# EAGLE design Basic arduino (EAGLE 9.6.2)
CNAME: MICROCONTOLLER+POWER+HEADERS; CREVISION: V1.0.0; TEST: Basic Arduino
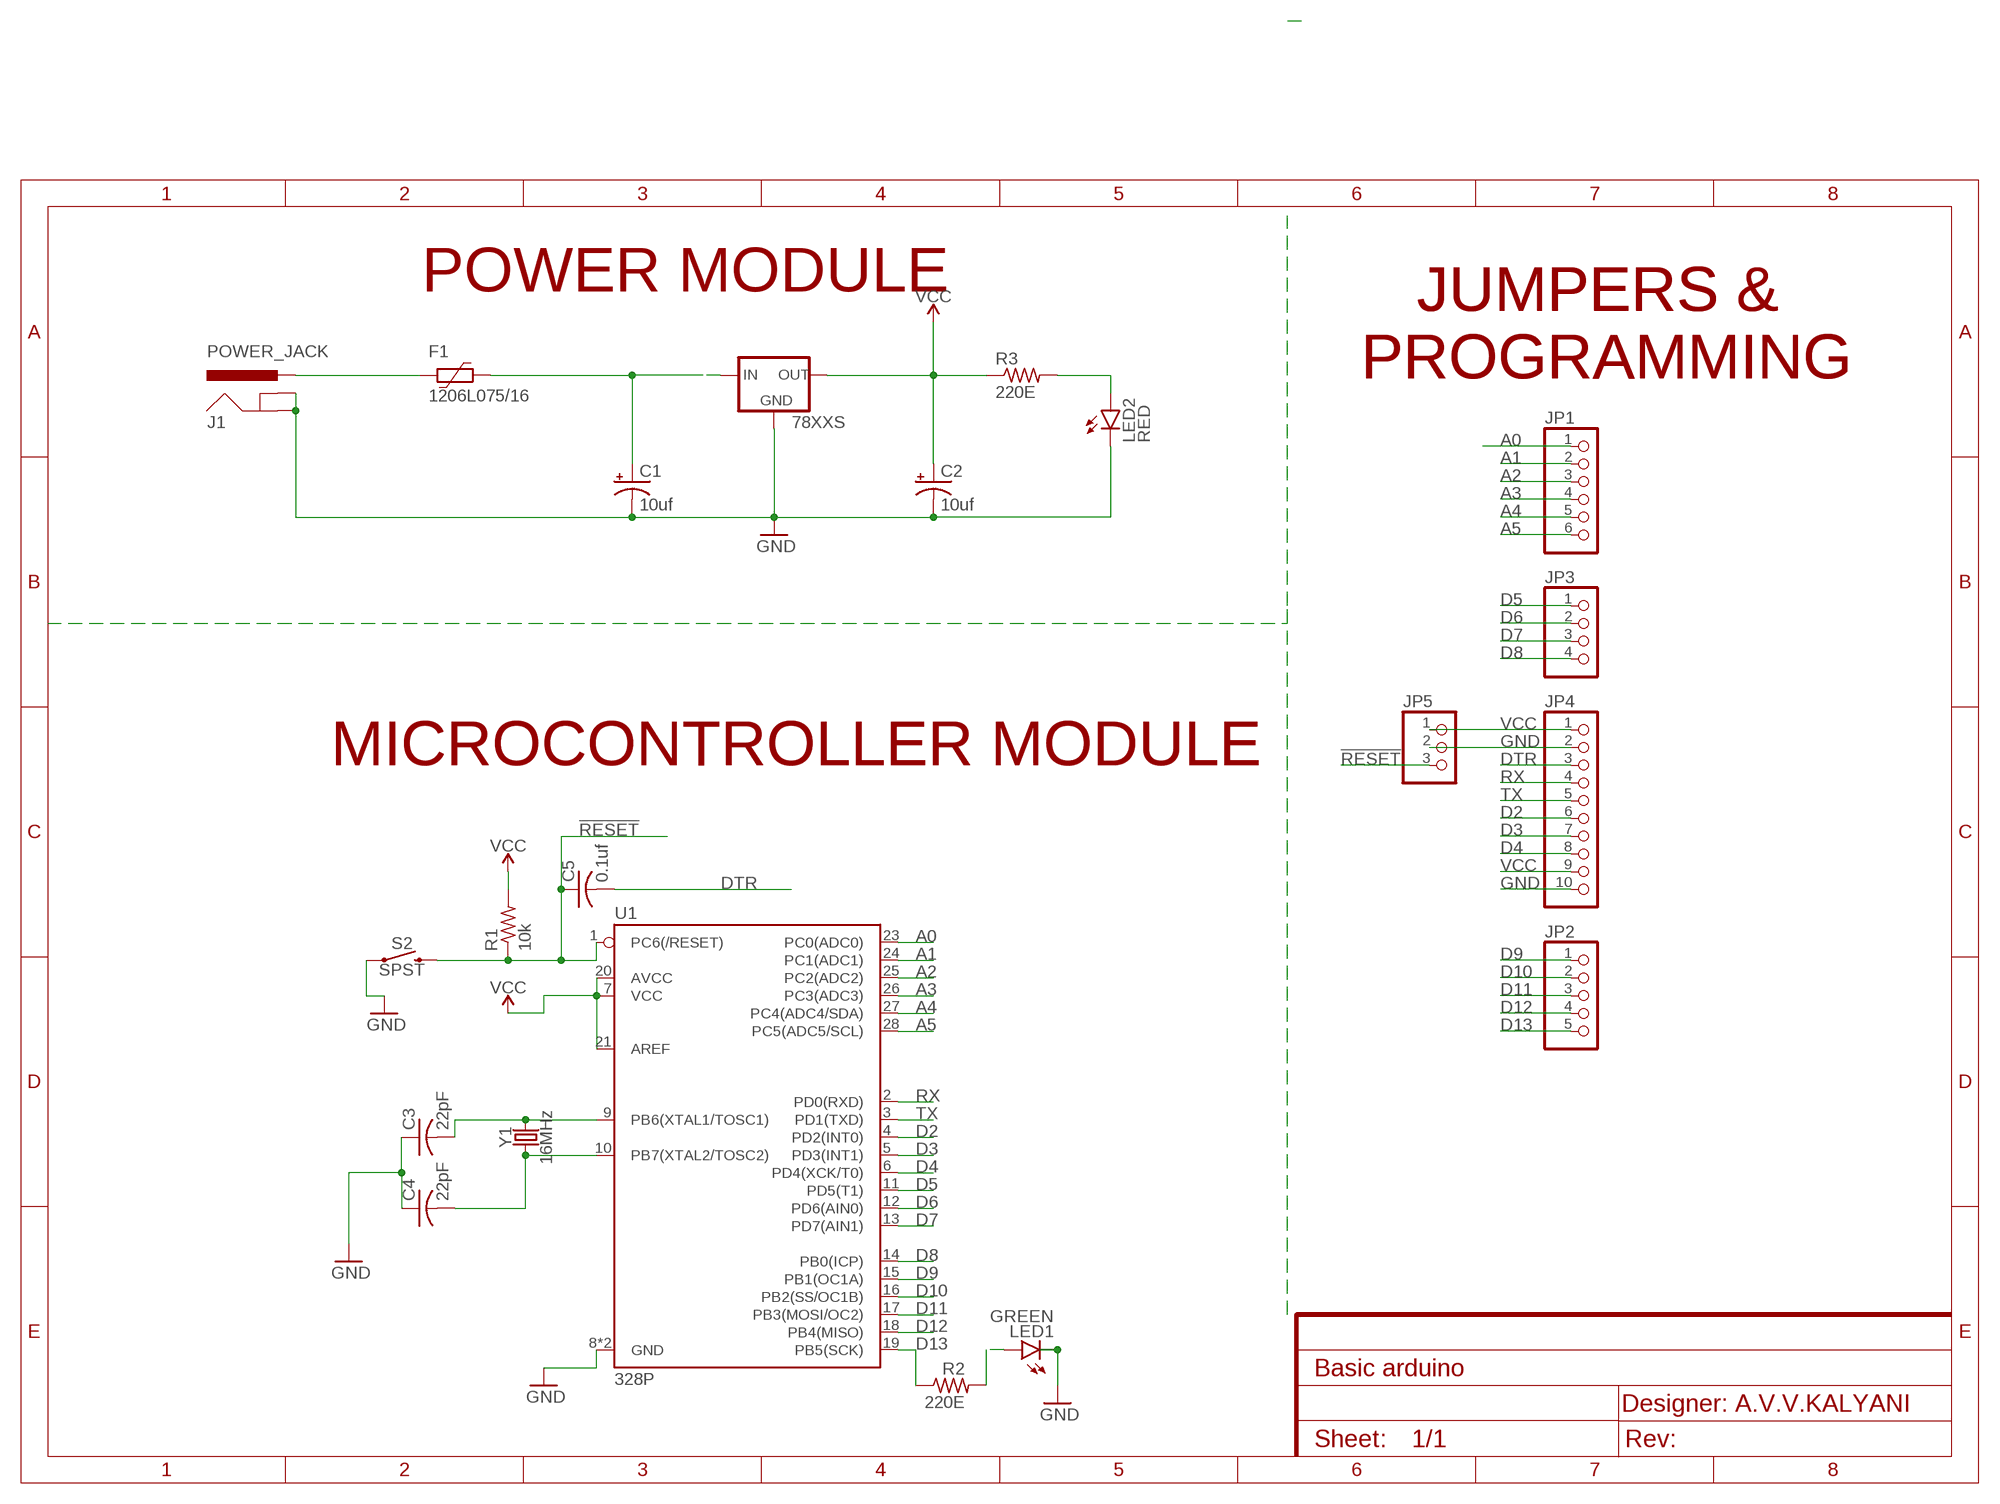
[diagram p0: schematic, sheet 1]

## Parts
78XXS  78XXS  [78XXS]
C1  10uf  CPOL-USE2.5-6  [E2,5-6]
C2  10uf  CPOL-USE2.5-6  [E2,5-6]
C3  22pF  C-US025-025X050  [C025-025X050]
C4  22pF  C-US025-025X050  [C025-025X050]
C5  0.1uf  C-US025-024X044  [C025-024X044]
F1  1206L075/16  [1206L]
J1  POWER_JACK  [POWER_JACK_PTH]
JP1  PINHD-1X6  [1X06]
JP2  PINHD-1X5  [1X05]
JP3  PINHD-1X4  [1X04]
JP4  PINHD-1X10  [1X10]
JP5  PINHD-1X3  [1X03]
LED1  GREEN  LED3MM  [LED3MM]
LED2  RED  LED3MM  [LED3MM]
R1  10k  R-US_0204/7  [0204/7]
R2  220E  R-US_0204/7  [0204/7]
R3  220E  R-US_0204/7  [0204/7]
S2  SPST  MOMENTARY-SWITCH-SPST-PTH-6.0MM  [TACTILE_SWITCH_PTH_6.0MM]
U1  328P  ATMEGA328P_PDIP  [DIP28]
Y1  16MHz  CRYSTAL-16MHZPTH-HC49US  [HC49US]

## Nets
!RESET: C5.1 JP5.3 R1.1 S2.3 U1.1(PC6(/RESET))
A0: JP1.1 U1.23(PC0(ADC0))
A1: JP1.2 U1.24(PC1(ADC1))
A2: JP1.3 U1.25(PC2(ADC2))
A3: JP1.4 U1.26(PC3(ADC3))
A4: JP1.5 U1.27(PC4(ADC4/SDA))
A5: JP1.6 U1.28(PC5(ADC5/SCL))
D2: JP4.6 U1.4(PD2(INT0))
D3: JP4.7 U1.5(PD3(INT1))
D4: JP4.8 U1.6(PD4(XCK/T0))
D5: JP3.1 U1.11(PD5(T1))
D6: JP3.2 U1.12(PD6(AIN0))
D7: JP3.3 U1.13(PD7(AIN1))
D8: JP3.4 U1.14(PB0(ICP))
D9: JP2.1 U1.15(PB1(OC1A))
D10: JP2.2 U1.16(PB2(SS/OC1B))
D11: JP2.3 U1.17(PB3(MOSI/OC2))
D12: JP2.4 U1.18(PB4(MISO))
D13: JP2.5 R2.1 U1.19(PB5(SCK))
DTR: C5.2 JP4.3
GND: 78XXS.GND C1.- C2.- C3.1 C4.1 J1.GND J1.GNDBREAK JP4.2 JP4.10 JP5.2 LED1.K(C) LED2.K(C) S2.1 U1.8(GND) U1.22(GND)
N$1: 78XXS.IN C1.+ F1.1
N$2: C3.2 U1.9(PB6(XTAL1/TOSC1)) Y1.2
N$3: C4.2 U1.10(PB7(XTAL2/TOSC2)) Y1.1
N$4: LED2.A R3.2
N$6: F1.2 J1.PWR
N$9: LED1.A R2.2
RX: JP4.4 U1.2(PD0(RXD))
TX: JP4.5 U1.3(PD1(TXD))
VCC: 78XXS.OUT C2.+ JP4.1 JP4.9 JP5.1 R1.2 R3.1 U1.7(VCC) U1.20(AVCC) U1.21(AREF)

## Notes on the sheet
- POWER MODULE
- JUMPERS & 
  PROGRAMMING
- JUMPERS & 
  PROGRAMMING
- JUMPERS & 
  PROGRAMMING
- MICROCONTROLLER MODULE | MICROCONTROLLER MODULE
- Designer: A.V.V.KALYANI

## Library data of the parts
78XXS = v-reg:78XXS: VOLTAGE REGULATOR
C1 C2 = rcl:CPOL-US: POLARIZED CAPACITOR, American symbol; SPICEPREFIX: C
C3-C5 = rcl:C-US: CAPACITOR, American symbol; SPICEPREFIX: C
F1 = polyfuse-smd_20:?: Polyfuse Resettable PTC Source: http://www.littelfuse.com/products/resettable-ptcs.aspx; MF: Littelfuse; MPN: 1206L075/16; OC_FARNELL: unknown; OC_NEWARK: unknown
J1 = SparkFun-Connectors:POWER_JACK: Power Jack Connector This is the standard 5.5mm barrel jack for power. The PTH is the most common, proven, reliable, footprint. The Slot footprint only works if the mill layer is transmitted to the PCB fab house so be warned. Here are the connectors we sell at SparkFun: DC Barrel Power Jack/Connector <https://www.sparkfun.com/products/119> (PRT-00119) DC Barrel Power Jack/Connector (SMD) <https://www.sparkfun.com/products/12748> (PRT-12748) DC Barrel Jack Adapter - Breadboard Compatible <https://www.sparkfun.com/products/10811> (PRT-10811) It is used on this SparkFun product (and many, many others): SparkFun RedBoard - Programmed with Arduino <https://www.sparkfun.com/products/12757> (DEV-12757) Also, if you need a mating power supply or connector, please check these out: Wall Adapter Power Supply - 9VDC 650mA <https://www.sparkfun.com/products/298> (TOL-00298) DC Barrel Jack Adapter - Male <https://www.sparkfun.com/products/10287> (PRT-10287); PROD_ID: CONN-08197
JP1 = pinhead:PINHD-1X6: PIN HEADER
JP2 = pinhead:PINHD-1X5: PIN HEADER
JP3 = pinhead:PINHD-1X4: PIN HEADER
JP4 = pinhead:PINHD-1X10: PIN HEADER
JP5 = pinhead:PINHD-1X3: PIN HEADER
LED1 LED2 = led:LED: LED OSRAM: - CHIPLED LG R971, LG N971, LY N971, LG Q971, LY Q971, LO R971, LY R971 LH N974, LH R974 LS Q976, LO Q976, LY Q976 LO Q996 - Hyper CHIPLED LW Q18S LB Q993, LB Q99A, LB R99A - SideLED LS A670, LO A670, LY A670, LG A670, LP A670 LB A673, LV A673, LT A673, LW A673 LH A674 LY A675 LS A676, LA A676, LO A676, LY A676, LW A676 LS A679, LY A679, LG A679 - Hyper Micro SIDELED® LS Y876, LA Y876, LO Y876, LY Y876 LT Y87S - SmartLED LW L88C, LW L88S LB L89C, LB L89S, LG L890 LS L89K, LO L89K, LY L89K LS L896, LA L896, LO L896, LY L896 - TOPLED LS T670, LO T670, LY T670, LG T670, LP T670 LSG T670, LSP T670, LSY T670, LOP T670, LYG T670 LG T671, LOG T671, LSG T671 LB T673, LV T673, LT T673, LW T673 LH T674 LS T676, LA T676, LO T676, LY T676, LB T676, LH T676, LSB T676, LW T676 LB T67C, LV T67C, LT T67C, LS T67K, LO T67K, LY T67K, LW E67C LS E67B, LA E67B, LO E67B, LY E67B, LB E67C, LV E67C, LT E67C LW T67C LS T679, LY T679, LG T679 LS T770, LO T770, LY T770, LG T770, LP T770 LB T773, LV T773, LT T773, LW T773 LH T774 LS E675, LA E675, LY E675, LS T675 LS T776, LA T776, LO T776, LY T776, LB T776 LHGB T686 LT T68C, LB T68C - Hyper Mini TOPLED® LB M676 - Mini TOPLED Santana® LG M470 LS M47K, LO M47K, LY M47K Source: http://www.osram.convergy.de LUXEON: - LUMILED® LXK2-PW12-R00, LXK2-PW12-S00, LXK2-PW14-U00, LXK2-PW14-V00 LXK2-PM12-R00, LXK2-PM12-S00, LXK2-PM14-U00 LXK2-PE12-Q00, LXK2-PE12-R00, LXK2-PE12-S00, LXK2-PE14-T00, LXK2-PE14-U00 LXK2-PB12-K00, LXK2-PB12-L00, LXK2-PB12-M00, LXK2-PB14-N00, LXK2-PB14-P00, LXK2-PB14-Q00 LXK2-PR12-L00, LXK2-PR12-M00, LXK2-PR14-Q00, LXK2-PR14-R00 LXK2-PD12-Q00, LXK2-PD12-R00, LXK2-PD12-S00 LXK2-PH12-R00, LXK2-PH12-S00 LXK2-PL12-P00, LXK2-PL12-Q00, LXK2-PL12-R00 Source: www.luxeon.com KINGBRIGHT: KA-3528ASYC Source: www.kingbright.com
R1-R3 = rcl:R-US_: RESISTOR, American symbol; SPICEPREFIX: R
S2 = SparkFun-Switches:MOMENTARY-SWITCH-SPST: Momentary Switch (Pushbutton) - SPST Normally-open (NO) SPST momentary switches (buttons, pushbuttons). Variants PTH-12MM - 12mm square, through-hole Momentary Pushbutton Switch - 12mm Square <https://www.sparkfun.com/products/9190> (COM-09190) PTH-6.0MM, PTH-6.0MM-KIT - 6.0mm square, through-hole Mini Pushbutton Switch <https://www.sparkfun.com/products/97> (COM-00097) KIT package intended for soldering kit's - only one side of pads' copper is exposed. PTH-RIGHT-ANGLE-KIT - Right-angle, through-hole Right Angle Tactile Button <https://www.sparkfun.com/products/10791> - Used on SparkFun BigTime Watch Kit <https://www.sparkfun.com/products/11734> SMD-12MM - 12mm square, surface-mount Tactile Button - SMD (12mm) <https://www.sparkfun.com/products/12993> (COM-12993) Used on SparkFun PicoBoard <https://www.sparkfun.com/products/11888> SMD-4.5MM - 4.5mm Square Trackball Switch Used on SparkFun Blackberry Trackballer Breakout <https://www.sparkfun.com/products/13169> SMD-4.6MMX2.8MM - 4.60mm x 2.80mm, surface mount Used on SparkFun Pro Micro - RP2040 <https://www.sparkfun.com/products/17717> SMD-5.2MM, SMD-5.2-REDUNDANT - 5.2mm square, surface-mount Mini Pushbutton Switch - SMD <https://www.sparkfun.com/products/8720> (COM-08720) Used on Arduino Pro Mini <https://www.sparkfun.com/products/11114> REDUNDANT package connects both switch circuits together SMD-6.0X3.5MM - 6.0 x 3.5mm, surface mount Momentary Reset Switch SMD <https://www.sparkfun.com/products/8229> (COM-08229) SMD-6.2MM-TALL - 6.2mm square, surface mount Tactile Button - SMD (6mm) <https://www.sparkfun.com/products/12992> Used on SparkFun Digital Sandbox <https://www.sparkfun.com/products/12651> SMD-RIGHT-ANGLE - Right-angle, surface mount Used on SparkFun Block for Intel® Edison - Arduino <https://www.sparkfun.com/products/13036>; PROD_ID: SWCH-08441; SF_SKU: COM-00097
U1 = SparkFun-IC-Microcontroller:ATMEGA328P_PDIP: Atmel 328P Through hole ATMEGA328P uC used in the Arduino 32kb flash, 1k EEPROM, 2k SRAM Datasheet <http://www.sparkfun.com/datasheets/Components/SMD/ATMega328.pdf> SparkFun Products Storefront component: AVR 28 Pin 20MHz 32K 6A/D - ATMega328P <https://www.sparkfun.com/products/9061> (COM-09061) SparkFun Simon Says - Through-Hole Soldering Kit <https://www.sparkfun.com/products/10547> (KIT-10547) SparkFun Learn to Solder - Simon Says <https://www.sparkfun.com/products/13708> (KIT-13708) SparkFun BigTime Watch Kit <https://www.sparkfun.com/products/11734> (KIT-11734) SparkFun ClockIt <https://www.sparkfun.com/products/10930> (KIT-10930) SparkFun Serial Enabled LCD Kit <https://www.sparkfun.com/products/10097> (LCD-10097) SparkFun Simon Tilts - Through Hole Soldering Kit <https://www.sparkfun.com/products/12634> (KIT-12634) SparkFun Frequency Counter Kit <https://www.sparkfun.com/products/10140> (KIT-10140) FabFM Radio Kit <https://www.sparkfun.com/products/11043> (KIT-11043) SparkFun Binary Blaster Kit <https://www.sparkfun.com/products/12037> (KIT-12037) SparkFun Metro-Gnome <https://www.sparkfun.com/products/9236> (KIT-09236) ATmega328 with Arduino Optiboot (Uno) <https://www.sparkfun.com/products/10524> (DEV-10524); PROD_ID: IC-09136
Y1 = SparkFun-Clocks:CRYSTAL-16MHZ: 16MHz Crystal Digikey Example <http://www.digikey.com/product-search/en?keywords=535-9122-1-ND> Frequency: 16MHz Frequency Stability: ±50ppm Frequency Tolerance: ±20ppm Load Capacitance: 18pF SparkFun Products: Pro Micro -5V/16MHz <https://www.sparkfun.com/products/12640> SparkFun Serial Enabled LCD Kit <https://www.sparkfun.com/products/10097>; PROD_ID: XTAL-08181; SF_ID: COM-00536

## Board
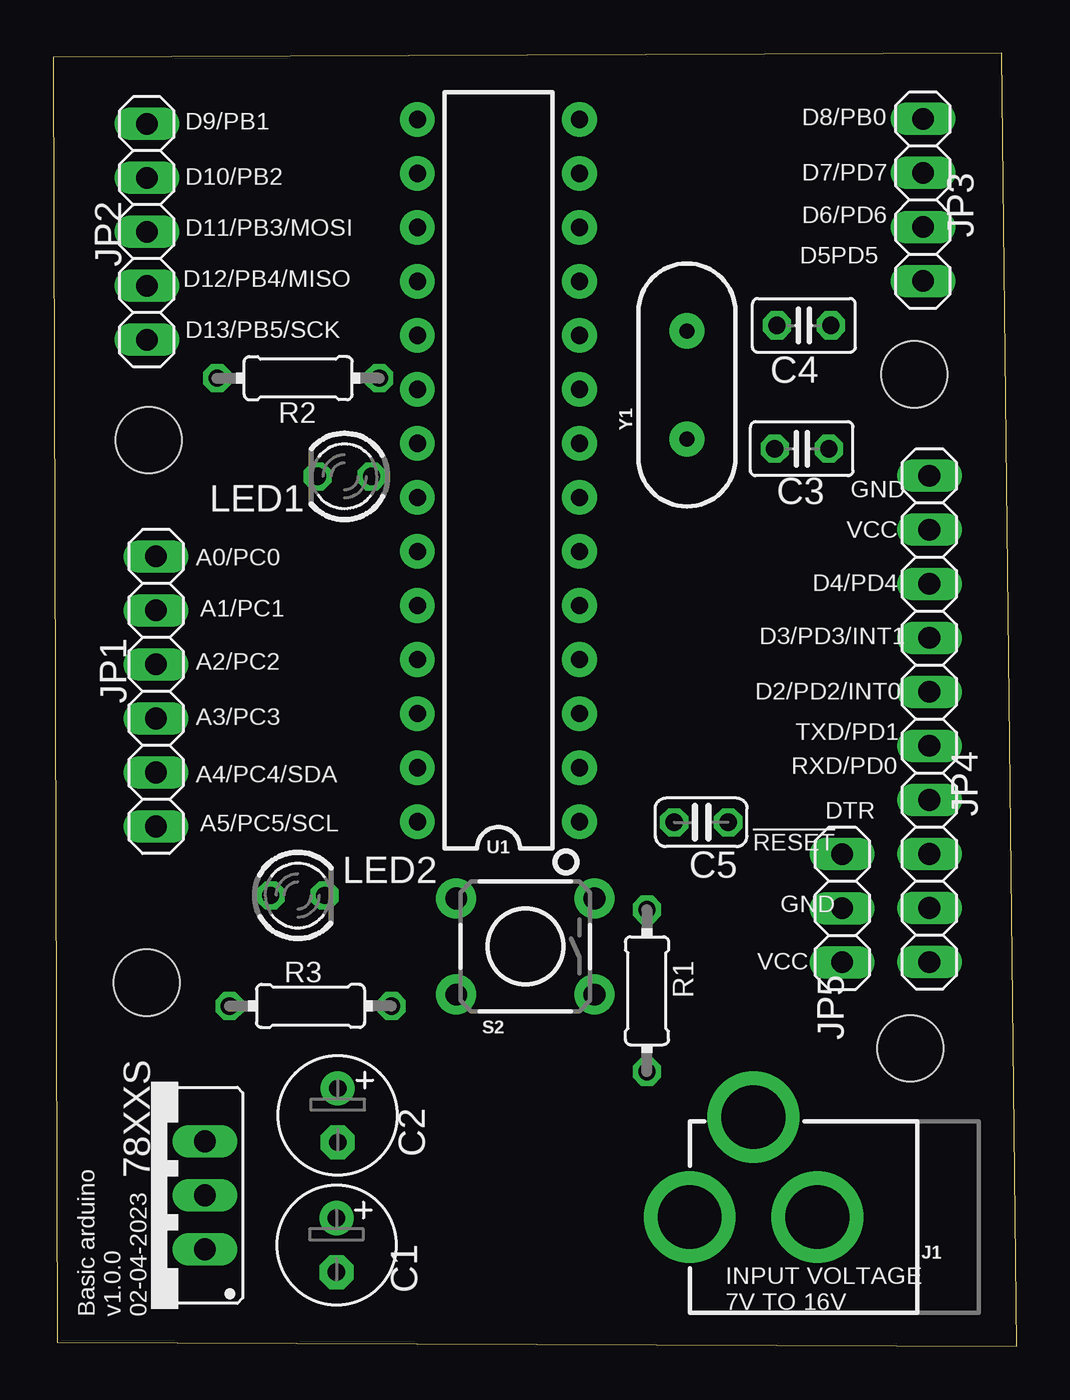
[diagram p1: board, top side]
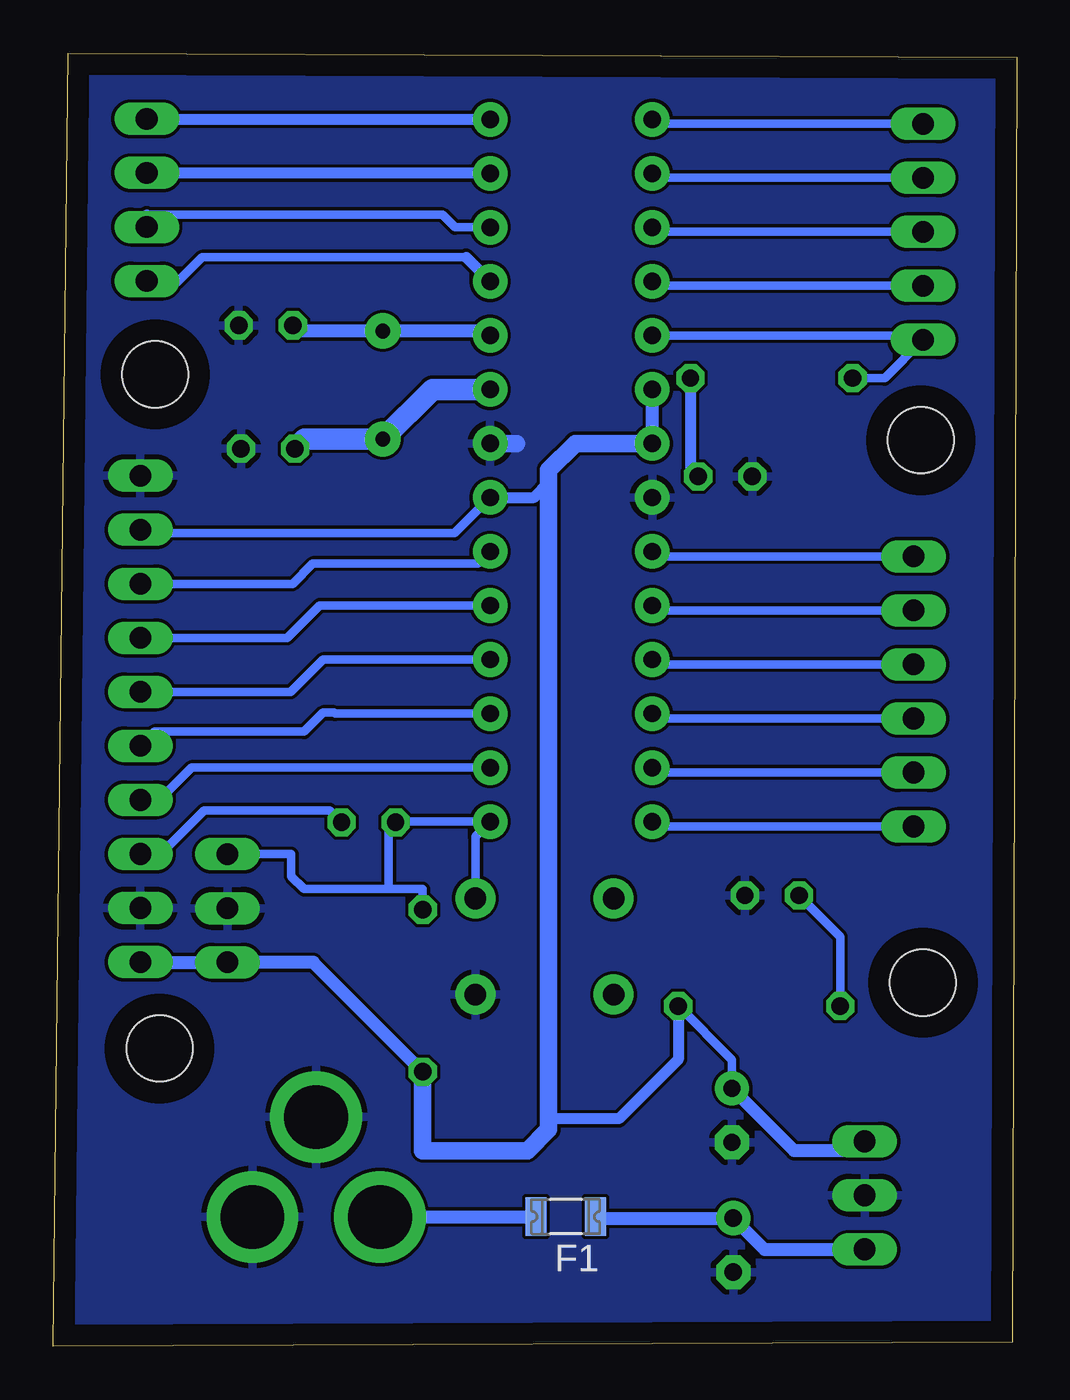
[diagram p2: board, bottom side, seen from below]

Size 45.3 x 60.8 mm. Coordinates in mm from the lower left corner, seen from the top.
Outline: 0.2,0.2 45.3,0 44.6,60.8 0,60.6 0.2,0.2
Copper layers (1*16): Top 0.035mm / dielectric 1.5mm / Bottom 0.035mm
Design rules "default": minimum track width 6mil, minimum drill 0.35mm, track to track 6mil, track to pad 6mil, pad to pad 6mil, via to via 6mil, smd to smd 6mil, copper to edge 40mil, drill to drill 6mil, minimum pad ring 10mil, minimum via ring 8mil, stop-mask expansion 4mil, vias tented up to drill 0mil, thermal gap 10mil
Holes 3.1 mm at 40.3,14 4.4,17.1 40.5,45.7 4.5,42.6

### Footprints (pad centres in the part's own frame; a part is rotated, then mirrored left to right if it is on the bottom)
78XXS = drill 1.016 long: GND 0,-2.54; IN -2.54,-2.54; OUT 2.54,-2.54
E2,5-6 = drill 0.813 pad 1.6: + -1.27,0 | drill 0.813 pad 1.6 octagon: - 1.27,0
C025-025X050 = drill 0.813 octagon: 1 -1.27,0; 2 1.27,0
C025-024X044 = drill 0.813 octagon: 1 -1.27,0; 2 1.27,0
1206L = smd 1 x 1.8: 1 -1.4,0; 2 1.4,0
POWER_JACK_PTH = drill 2.997 pad 4.318: GND 0,7.7; GNDBREAK 4.7,10.7; PWR 0,13.7
1X06 = drill 1.016 long: 1 -6.35,0; 2 -3.81,0; 3 -1.27,0; 4 1.27,0; 5 3.81,0; 6 6.35,0
1X05 = drill 1.016 long: 1 -5.08,0; 2 -2.54,0; 3 0,0; 4 2.54,0; 5 5.08,0
1X04 = drill 1.016 long: 1 -3.81,0; 2 -1.27,0; 3 1.27,0; 4 3.81,0
1X10 = drill 1.016 long: 1 -11.43,0; 2 -8.89,0; 3 -6.35,0; 4 -3.81,0; 5 -1.27,0; 6 1.27,0; 7 3.81,0; 8 6.35,0; 9 8.89,0; 10 11.43,0
1X03 = drill 1.016 long: 1 -2.54,0; 2 0,0; 3 2.54,0
LED3MM = drill 0.813 octagon: A -1.27,0; K 1.27,0
0204/7 = drill 0.813 octagon: 1 -3.81,0; 2 3.81,0
TACTILE_SWITCH_PTH_6.0MM = drill 1.016 pad 1.88: 1 -3.251,2.261; 2 3.251,2.261; 3 -3.251,-2.261; 4 3.251,-2.261
DIP28 = drill 0.813 pad 1.626: 1 -16.51,-3.81; 2 -13.97,-3.81; 3 -11.43,-3.81; 4 -8.89,-3.81; 5 -6.35,-3.81; 6 -3.81,-3.81; 7 -1.27,-3.81; 8 1.27,-3.81; 9 3.81,-3.81; 10 6.35,-3.81; 11 8.89,-3.81; 12 11.43,-3.81; 13 13.97,-3.81; 14 16.51,-3.81; 15 16.51,3.81; 16 13.97,3.81; 17 11.43,3.81; 18 8.89,3.81; 19 6.35,3.81; 20 3.81,3.81; 21 1.27,3.81; 22 -1.27,3.81; 23 -3.81,3.81; 24 -6.35,3.81; 25 -8.89,3.81; 26 -11.43,3.81; 27 -13.97,3.81; 28 -16.51,3.81
HC49US = drill 0.7 pad 1.651: 1 -2.54,0; 2 2.54,0

### Placement (x,y rotation side)
78XXS  4.6,7.1 90 top
C1  13.32,4.76 270 top
C2  13.38,10.86 270 top
C3  35.2,42.2 180 top
C4  35.3,48 180 top
C5  30.47,24.64 0 top
F1  21.2,6.1 180 bottom
J1  43.63,6.08 90 top
JP1  4.84,30.79 270 top
JP2  4.4,52.4 270 top
JP3  40.9,53.9 90 top
JP4  41.2,29.5 90 top
JP5  37.1,20.6 90 top
LED1  13.7,40.9 180 top
LED2  11.5,21.2 0 top
R1  27.92,16.72 270 top
R2  11.52,45.52 0 top
R3  12.1,16 180 top
S2  22.2,18.8 180 top
U1  20.94,41.18 90 top
Y1  29.8,45.2 270 top

### Tracks (layer width: path | path; a pad name or v marks a point on that pad's centre or on a via)
!RESET
  Bottom 0.406: 29.52,21.5 29.52,24.32 C5.1 29.17,24.67 U1.1 25.45,23.97 S2.3 | R1.1 27.92,21.5 29.52,21.5 | JP5.3 34.1,23.14 34.1,22.1 33.5,21.5 29.52,21.5
A0
  Bottom 0.406: JP1.1 16.9,37.14 U1.23
A1
  Bottom 0.406: JP1.2 16.9,34.6 U1.24
A2
  Bottom 0.406: JP1.3 16.9,32.06 U1.25
A3
  Bottom 0.406: JP1.4 16.9,29.52 U1.26
A4
  Bottom 0.406: JP1.5 16.9,26.98 U1.27
A5
  Bottom 0.406: JP1.6 16.9,24.44 U1.28
D2
  Bottom 0.406: U1.4 32.61,32.29 34.13,30.77 JP4.6
D3
  Bottom 0.406: U1.5 32.77,34.83 34.29,33.31 JP4.7
D4
  Bottom 0.406: JP4.8 34.05,35.85 33.1,36.8 25.32,36.8 U1.6
D5
  Bottom 0.406: JP3.1 40.81,50 39.5,50 38.3,51.2 25.88,51.2
  Bottom 0.508: U1.11 25.88,51.2
D6
  Bottom 0.406: U1.12 26.41,52.61 27,53.2 40.9,53.2
  Bottom 0.508: JP3.2 40.9,53.2
D7
  Bottom 0.508: U1.13 40.88,55.15 JP3.3
D8
  Bottom 0.508: U1.14 40.68,57.69 40.9,57.91 JP3.4
D9
  Bottom 0.406: JP2.1 16.92,57.48 U1.15
D10
  Bottom 0.406: JP2.2 16.92,54.94 U1.16
D11
  Bottom 0.406: JP2.3 16.92,52.4 U1.17
D12
  Bottom 0.406: JP2.4 16.92,49.86 U1.18
D13
  Bottom 0.406: U1.19 4.61,47.53 JP2.5 6.2,45.52 R2.1
DTR
  Bottom 0.406: C5.2 32.3,25.2 38.2,25.2 40.25,23.15 JP4.3
GND
  Bottom 0.406: U1.8 23.55,42.45
  Bottom 0.61: 40.81,20.61 JP4.2
  Bottom 0.813: U1.8 23.52,42.45
  pour Bottom: 0,-0.2 45,-0.2 45,60.6 0,60.6
N$1
  Bottom 0.61: F1.1 19.73,6.03 C1.+ 11.85,4.56 78XXS.IN
N$2
  Bottom 1.016: U1.9 27.47,44.99 Y1.2 33.47,42.66 C3.2
N$3
  Bottom 0.61: U1.10 24.96,47.74 Y1.1 33.77,47.74 C4.2
N$4
  Bottom 0.406: LED2.A 8.29,19.26 R3.2
N$6
  Bottom 0.61: J1.PWR 22.62,6.08 F1.2
N$9
  Bottom 0.508: R2.2 15.33,41.26 LED1.A
RX
  Bottom 0.406: U1.2 38.79,27.21 40.31,25.69 JP4.4
TX
  Bottom 0.406: U1.3 32.05,29.75 32.1,29.8 32.6,29.8 33.5,28.9 40.53,28.9 JP4.5
VCC
  Bottom 0.406: U1.7 26.43,38.23 41.04,38.23 JP4.9 | R3.1 13.38,13.47 C2.+
  Bottom 0.508: U1.7 22.69,39.91 22,40.6 | R3.1 15.91,13.49 18.7,10.7 22,10.7
  Bottom 0.61: 78XXS.OUT 7.58,9.2 10.45,9.2 C2.+ | R1.2 33.07,18.06 JP5.1 JP4.1 | U1.21 U1.20
  Bottom 0.813: R1.2 27.92,9.2 23,9.2 22,10.2 22,10.7 22,40.6 22,41.2 20.75,42.45 U1.21

### Text on the board
tNames: D9/PB1 | D8/PB0 | D7/PD7 | D10/PB2 | D6/PD6 | D11/PB3/MOSI | D5PD5 | D12/PB4/MISO | D13/PB5/SCK | GND | VCC | A0/PC0 | D4/PD4 | A1/PC1 | D3/PD3/INT1 | A2/PC2 | D2/PD2/INT0 | A3/PC3 | TXD/PD1 | RXD/PD0 | A4/PC4/SDA | DTR | A5/PC5/SCL | !RESET | GND | VCC | Basic arduino / v1.0.0 / 02-04-2023 | INPUT VOLTAGE / 7V TO 16V